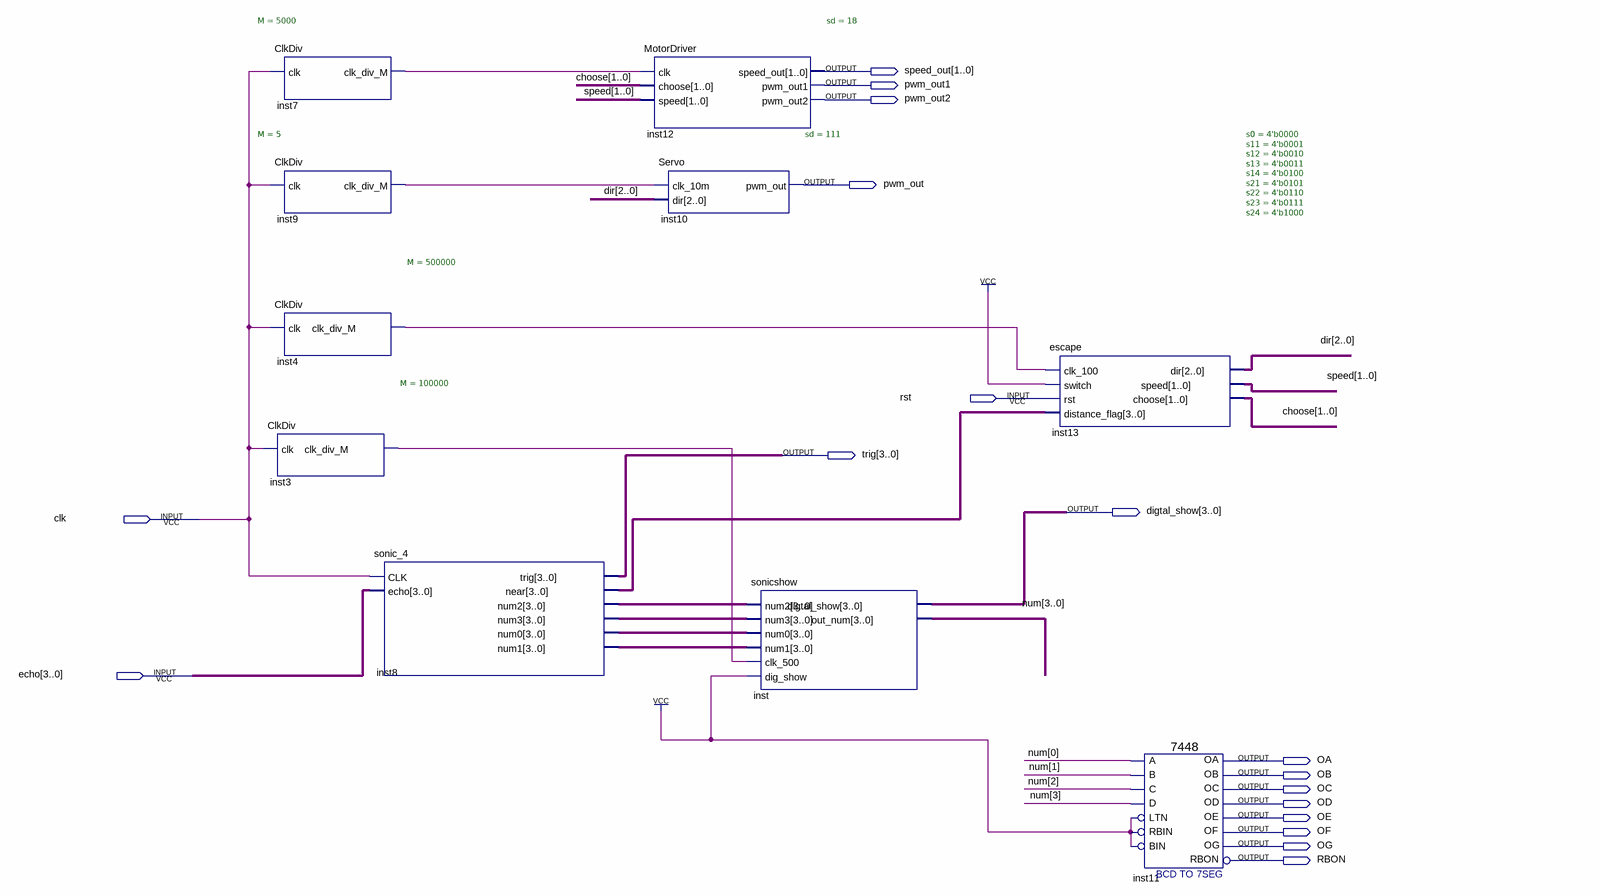
[diagram p0: schematic sheet]
// Quartus schematic escapetry.bdf as structural Verilog: 10 symbols, 17 pins
module escapetry (
  input  rst,
  input  clk,
  input  [3:0] echo,
  output [1:0] speed_out,
  output pwm_out1,
  output pwm_out2,
  output pwm_out,
  output [3:0] trig,
  output [3:0] digtal_show,
  output OA,
  output OB,
  output OC,
  output OD,
  output OE,
  output OF,
  output OG,
  output RBON
);

  wire inst3_clk_div_m, inst4_clk_div_m, inst7_clk_div_m, inst9_clk_div_m;
  wire [1:0] choose, speed;
  wire [2:0] dir;
  wire [3:0] inst8_near, inst8_num0, inst8_num1, inst8_num2, inst8_num3, num;

  ClkDiv #(.M(5000)) inst7 (.clk(clk), .clk_div_M(inst7_clk_div_m));
  ClkDiv #(.M(5)) inst9 (.clk(clk), .clk_div_M(inst9_clk_div_m));
  ClkDiv #(.M(500000)) inst4 (.clk(clk), .clk_div_M(inst4_clk_div_m));
  ClkDiv #(.M(100000)) inst3 (.clk(clk), .clk_div_M(inst3_clk_div_m));
  sonic_4 inst8 (
    .CLK(clk), .echo(echo), .trig(trig), .near(inst8_near), .num2(inst8_num2), .num3(inst8_num3),
    .num0(inst8_num0), .num1(inst8_num1));
  MotorDriver #(.sd(18)) inst12 (
    .clk(inst7_clk_div_m), .choose(choose), .speed(speed), .speed_out(speed_out), .pwm_out1(pwm_out1),
    .pwm_out2(pwm_out2));
  Servo #(.sd(111)) inst10 (.clk_10m(inst9_clk_div_m), .dir(dir), .pwm_out(pwm_out));
  sonicshow inst (
    .num2(inst8_num2), .num3(inst8_num3), .num0(inst8_num0), .num1(inst8_num1), .clk_500(inst3_clk_div_m),
    .dig_show(1'b1), .digtal_show(digtal_show), .out_num(num));
  escape #(.s0(4'b0000), .s11(4'b0001), .s12(4'b0010), .s13(4'b0011), .s14(4'b0100), .s21(4'b0101), .s22(4'b0110), .s23(4'b0111), .s24(4'b1000)) inst13 (
    .clk_100(inst4_clk_div_m), .switch(1'b1), .rst(rst), .distance_flag(inst8_near), .dir(dir),
    .speed(speed), .choose(choose));
  \7448  inst11 (
    .A(num[0]), .C(num[2]), .D(num[3]), .B(num[1]), .RBIN(1'b1), .BIN(1'b1), .LTN(1'b1), .OC(OC), .OE(OE),
    .OD(OD), .OF(OF), .OG(OG), .OB(OB), .OA(OA), .RBON(RBON));
endmodule
